# Altium schematic sheet SensWear_Debug.SchDoc
size A4; Size: A4; SheetNumber: 7; SheetTotal: 9
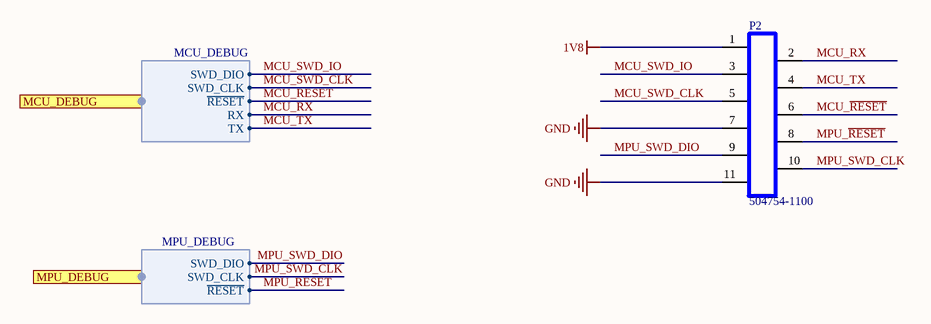
[diagram p0: SensWear_Debug.SchDoc]

## Parts
P2  504754-1100  [5047541100]

## Ports
MCU_DEBUG (harness MCU_DEBUG), MPU_DEBUG (harness MPU_DEBUG)

## Harnesses
MPU_DEBUG: SWD_DIO, SWD_CLK, ~{RESET}
MCU_DEBUG: SWD_DIO, SWD_CLK, ~{RESET}, RX, TX

## Nets
1V8: P2.1
GND: P2.7 P2.11
MCU_~{RESET}: P2.6 ; port MCU_DEBUG.~{RESET}
MCU_RX: P2.2 ; port MCU_DEBUG.RX
MCU_SWD_CLK: P2.5 ; port MCU_DEBUG.SWD_CLK
MCU_SWD_IO: P2.3 ; port MCU_DEBUG.SWD_DIO
MCU_TX: P2.4 ; port MCU_DEBUG.TX
MPU_~{RESET}: P2.8 ; port MPU_DEBUG.~{RESET}
MPU_SWD_CLK: P2.10 ; port MPU_DEBUG.SWD_CLK
MPU_SWD_DIO: P2.9 ; port MPU_DEBUG.SWD_DIO

## Notes on the sheet
- Designer/Engineer
- Drawn By
- Document Name
- Board Title
- Sheet
- of
- Size
- A4
- Approved By
- Rev.
- Date

## Library data of the parts
P2 = 504754-1100: Conn FFC/FPC Connector SKT 11 POS 0.3mm Solder RA SMD Easy-On™ T/R; Manufacturer: Molex; CHECKED: FALSE; Supplier: Mouser; Supplier Part Number: 538-504754-1100; Manufacturer Part Number: 504754-1100; RoHS: No; Stock: 6459; Pricing: 1=0.77, 10=0.628, 50=0.544, 100=0.512, 1000=0.426, 10000=0.355 (USD); ComponentLink1URL: https://datasheet.octopart.com/504754-1100-Molex-datasheet-169278456.pdf?src-supplier=Farnell; ComponentLink1Description: https://datasheet.octopart.com/504754-1100-Molex-datasheet-169278456.pdf?src-supplier=Farnell; ComponentLink2URL: http://datasheet.octopart.com/5047541100-Molex-datasheet-38188796.pdf?src-supplier=Onlinecomponents.com; ComponentLink2Description: http://datasheet.octopart.com/5047541100-Molex-datasheet-38188796.pdf?src-supplier=Onlinecomponents.com; ComponentLink3URL: http://datasheet.octopart.com/5047541100-Molex-datasheet-38188796.pdf?src-supplier=Verical; ComponentLink3Description: http://datasheet.octopart.com/5047541100-Molex-datasheet-38188796.pdf?src-supplier=Verical; ComponentLink4URL: http://datasheet.octopart.com/5047541100-Molex-datasheet-38188796.pdf?src-supplier=Avnet; ComponentLink4Description: http://datasheet.octopart.com/5047541100-Molex-datasheet-38188796.pdf?src-supplier=Avnet; ComponentLink5URL: http://datasheet.octopart.com/5047541100-Molex-datasheet-38188796.pdf?src-supplier=TTI; ComponentLink5Description: http://datasheet.octopart.com/5047541100-Molex-datasheet-38188796.pdf?src-supplier=TTI; ComponentLink6URL: http://datasheet.octopart.com/5047541100-Molex-datasheet-38188796.pdf?src-supplier=Electro+Sonic; ComponentLink6Description: http://datasheet.octopart.com/5047541100-Molex-datasheet-38188796.pdf?src-supplier=Electro+Sonic; ComponentLink7URL: https://datasheet.octopart.com/504754-1100-Molex-datasheet-154754160.pdf?src-supplier=Master+Electronics; ComponentLink7Description: https://datasheet.octopart.com/504754-1100-Molex-datasheet-154754160.pdf?src-supplier=Master+Electronics; Supplier 1: Mouser; Supplier Part Number 1: 538-504754-1100